# Altium schematic sheet LM317Shamtics.SchDoc
size A4
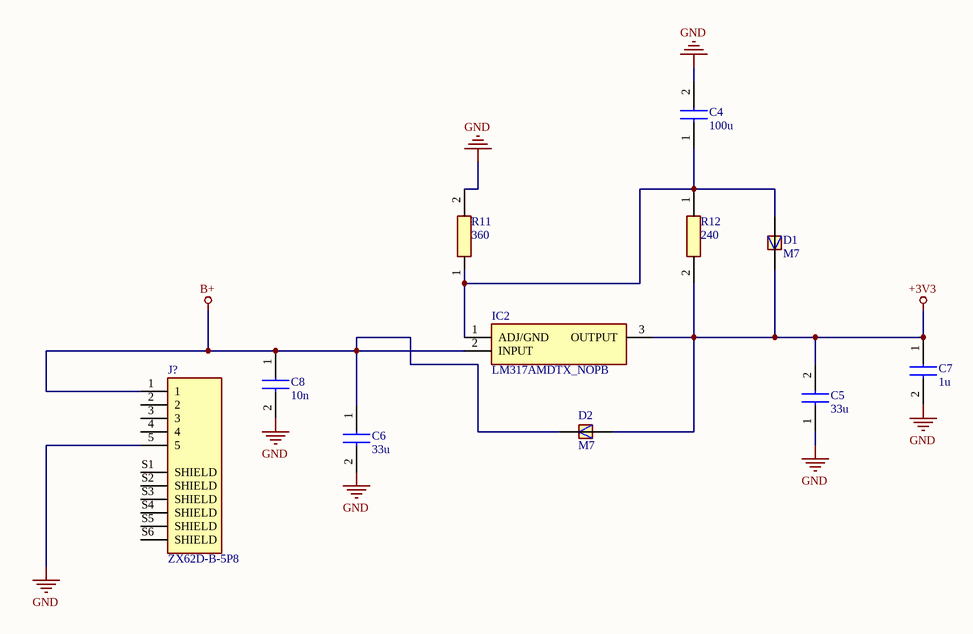
[diagram p0: LM317Shamtics.SchDoc]

## Parts
C4  100u  [CAPC2013X140N]
C5  33u  [CAPC2013X140N]
C6  33u  [CAPC2013X140N]
C7  1u  [CAPC2013X140N]
C8  10n  [CAPC2013X140N]
D1  M7  [DIOM505270X240]
D2  M7  [DIOM505270X240]
IC2  LM317AMDTX_NOPB  [LM78M05CDT]
J?  ZX62D-B-5P8  [HRS_ZX62D-B-5P8]
R11  360  [RESC2012X65N]
R12  240  [RESC2012X65N]

## Nets
+3V3: C5.2(C2) C7.1(C1) D1.C D2.A IC2.3(OUTPUT) R12.2
B+: C6.1(C1) C8.1(C1) D2.C IC2.2(INPUT) J?.1
GND: C4.2(C2) C5.1(C1) C6.2(C2) C7.2(C2) C8.2(C2) J?.5 R11.2
NetC4_1: C4.1(C1) D1.A IC2.1(ADJ/GND) R11.1 R12.1

Not connected (* = marked no-connect by the designer): J? 2 3 4 S1(SHIELD) S2(SHIELD) S3(SHIELD) S4(SHIELD) S5(SHIELD) S6(SHIELD)

## Library data of the parts
C4-C8 = 08053C474JAT2A: Capacitor; Manufacturer_Name: Kyocera AVX; Manufacturer_Part_Number: 08053C474JAT2A; Mouser Part Number: 581-08053C474JAT2A; Mouser Price/Stock: https://www.mouser.co.uk/ProductDetail/KYOCERA-AVX/08053C474JAT2A?qs=bb%252B1MDm7h6L8wnHciIrwGg%3D%3D
D1 D2 = M7: Diode, SMA, 1000V, 1A, 150°C; MF: Diotec Semiconductor; SnapEDA_Link: https://www.snapeda.com/parts/M7/Diotec/view-part/?ref=snap; Package: DO-214AC Diotec; Value: *; MP: M7; Check_prices: https://www.snapeda.com/parts/M7/Diotec/view-part/?ref=eda
IC2 = LM317AMDTX_NOPB: Integrated Circuit; Manufacturer_Name: Texas Instruments; Manufacturer_Part_Number: LM317AMDTX/NOPB; Datasheet Link: http://www.ti.com/lit/gpn/lm317a; Mouser Part Number: 926-LM317AMDTX/NOPB; Mouser Price/Stock: https://www.mouser.co.uk/ProductDetail/Texas-Instruments/LM317AMDTX-NOPB?qs=X1J7HmVL2ZE2tJdeke3r6w%3D%3D; Arrow Part Number: LM317AMDTX/NOPB; Arrow Price/Stock: https://www.arrow.com/en/products/lm317amdtxnopb/texas-instruments?region=nac
J? = ZX62D-B-5P8: USB - micro B USB 2.0 Receptacle Connector 5 Position Surface Mount, Right Angle; Through Hole; MF: Hirose Connector; Package: None; Check_prices: https://www.snapeda.com/parts/ZX62D-B-5P8/Hirose/view-part/?ref=eda; Price: None; Purchase-URL: https://pricing.snapeda.com/search/part/ZX62D-B-5P8/?ref=eda; MP: ZX62D-B-5P8; Value: *; SnapEDA_Link: https://www.snapeda.com/parts/ZX62D-B-5P8/Hirose/view-part/?ref=snap; Availability: In Stock
R11 R12 = CPF0805B102RE1: Resistor; Manufacturer_Name: TE Connectivity; Datasheet Link: http://docs-europe.electrocomponents.com/webdocs/13d1/0900766b813d116f.pdf; Height: 0.65mm; Manufacturer_Part_Number: CPF0805B102RE1